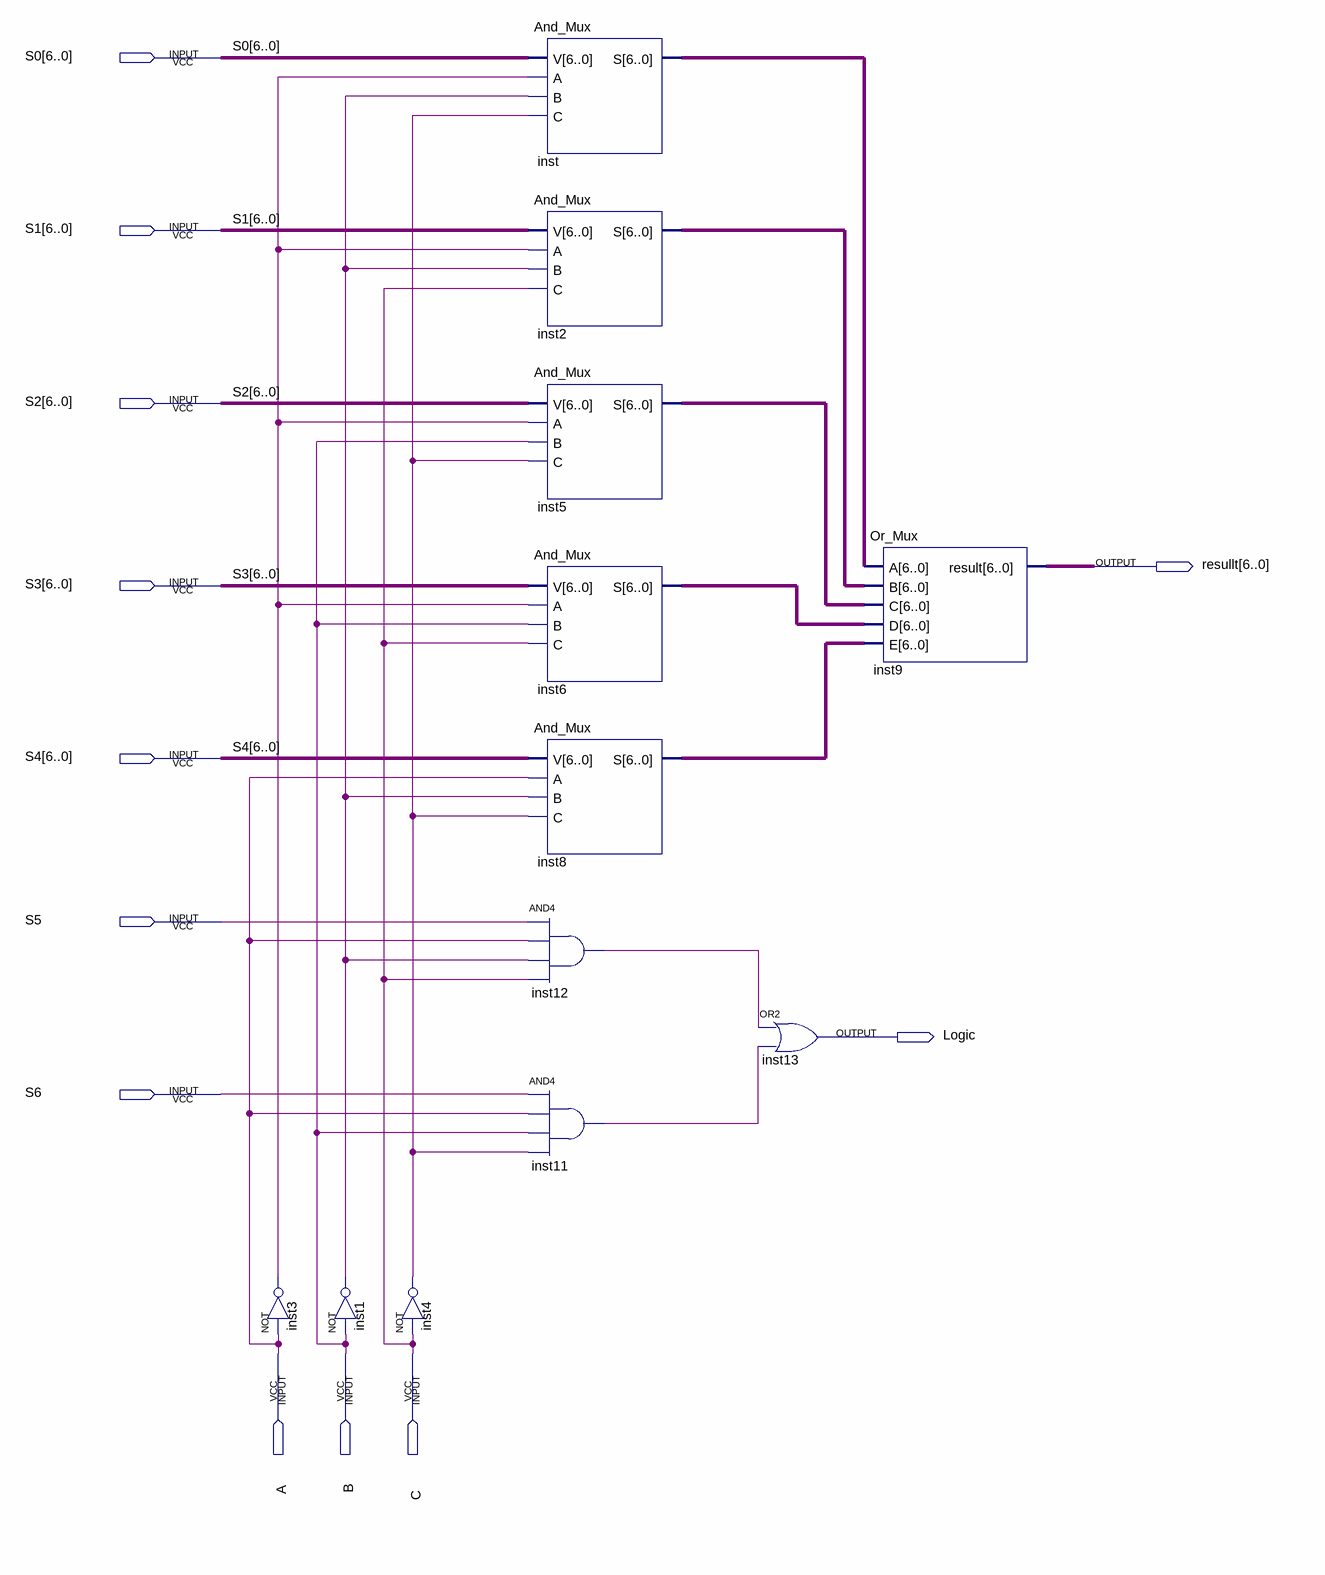
[diagram p0: schematic sheet]
// Quartus schematic Seven_bit_Mux.bdf as structural Verilog: 12 symbols, 12 pins
module Seven_bit_Mux (
  input  [6:0] S0,
  input  [6:0] S1,
  input  [6:0] S2,
  input  [6:0] S3,
  input  [6:0] S4,
  input  S5,
  input  S6,
  input  A,
  input  B,
  input  C,
  output [6:0] resullt,
  output Logic
);

  wire inst1_out, inst3_out, inst4_out, inst11_out, inst12_out;
  wire [6:0] inst2_s, inst5_s, inst6_s, inst8_s, inst_s;

  not inst3 (inst3_out, A);
  not inst1 (inst1_out, B);
  not inst4 (inst4_out, C);
  And_Mux inst (.V(S0), .A(inst3_out), .B(inst1_out), .C(inst4_out), .S(inst_s));
  And_Mux inst2 (.V(S1), .A(inst3_out), .B(inst1_out), .C(C), .S(inst2_s));
  And_Mux inst5 (.V(S2), .A(inst3_out), .B(B), .C(inst4_out), .S(inst5_s));
  And_Mux inst6 (.V(S3), .A(inst3_out), .B(B), .C(C), .S(inst6_s));
  And_Mux inst8 (.V(S4), .A(A), .B(inst1_out), .C(inst4_out), .S(inst8_s));
  and inst12 (inst12_out, S5, A, inst1_out, C);
  and inst11 (inst11_out, S6, A, B, inst4_out);
  or inst13 (Logic, inst12_out, inst11_out);
  Or_Mux inst9 (.A(inst_s), .B(inst2_s), .C(inst5_s), .D(inst6_s), .E(inst8_s), .result(resullt));
endmodule
